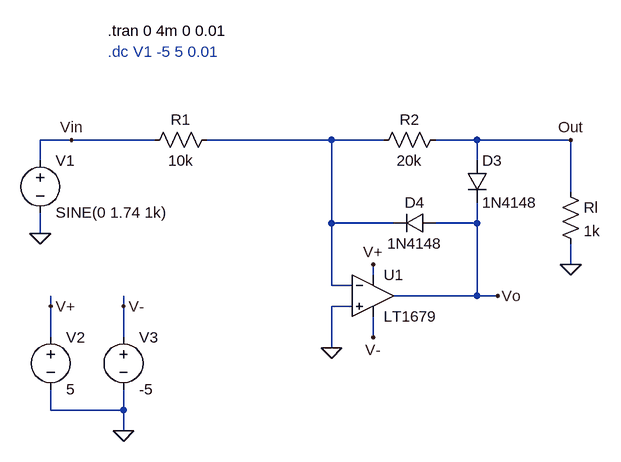
[diagram p0: schematic Etaj_4_monoalternanta.asc]
Etaj_4_monoalternanta.asc, the LTspice schematic file:
Version 4.1
SHEET 1 880 680
WIRE -528 -272 -576 -272
WIRE -400 -272 -528 -272
WIRE -128 -272 -320 -272
WIRE -48 -272 -128 -272
WIRE 96 -272 32 -272
WIRE 240 -272 96 -272
WIRE -576 -240 -576 -272
WIRE 96 -240 96 -272
WIRE 240 -192 240 -272
WIRE -128 -144 -128 -272
WIRE -32 -144 -128 -144
WIRE 96 -144 96 -176
WIRE 96 -144 32 -144
WIRE -576 -128 -576 -160
WIRE 240 -80 240 -112
WIRE -64 -64 -64 -80
WIRE -128 -48 -128 -144
WIRE -96 -48 -128 -48
WIRE 96 -32 96 -144
WIRE 96 -32 -32 -32
WIRE 128 -32 96 -32
WIRE -560 -16 -560 -32
WIRE -448 -16 -448 -32
WIRE -96 -16 -128 -16
WIRE -560 32 -560 -16
WIRE -448 32 -448 -16
WIRE -64 32 -64 0
WIRE -128 48 -128 -16
WIRE -560 144 -560 112
WIRE -448 144 -448 112
WIRE -448 144 -560 144
WIRE -448 176 -448 144
FLAG -576 -128 0
FLAG 240 -272 Out
FLAG -128 48 0
FLAG 128 -32 Vo
FLAG -448 176 0
FLAG -560 -16 V+
FLAG -448 -16 V-
FLAG -64 -80 V+
FLAG -64 32 V-
FLAG -528 -272 Vin
FLAG 240 -80 0
SYMBOL res -304 -288 R90
WINDOW 0 0 56 VBottom 2
WINDOW 3 32 56 VTop 2
SYMATTR InstName R1
SYMATTR Value 10k
SYMBOL voltage -576 -256 R0
WINDOW 123 0 0 Left 2
WINDOW 39 0 0 Left 2
SYMATTR InstName V1
SYMATTR Value SINE(0 1.74 1k)
SYMBOL voltage -560 16 R0
WINDOW 123 0 0 Left 2
WINDOW 39 0 0 Left 2
SYMATTR InstName V2
SYMATTR Value 5
SYMBOL voltage -448 16 R0
WINDOW 123 0 0 Left 2
WINDOW 39 0 0 Left 2
SYMATTR InstName V3
SYMATTR Value -5
SYMBOL res 48 -288 R90
WINDOW 0 0 56 VBottom 2
WINDOW 3 32 56 VTop 2
SYMATTR InstName R2
SYMATTR Value 20k
SYMBOL diode 80 -240 R0
SYMATTR InstName D3
SYMATTR Value 1N4148
SYMBOL diode 32 -160 R90
WINDOW 0 0 32 VBottom 2
WINDOW 3 32 32 VTop 2
SYMATTR InstName D4
SYMATTR Value 1N4148
SYMBOL res 224 -208 R0
SYMATTR InstName Rl
SYMATTR Value 1k
SYMBOL OpAmps\\LT1679 -64 -32 R0
SYMATTR InstName U1
TEXT -472 -440 Left 2 !.tran 0 4m 0 0.01
TEXT -472 -408 Left 2 ;.dc V1 -5 5 0.01

The netlist it stands for:
* Etaj_4_monoalternanta.asc
R1 N001 Vin 10k
V1 Vin 0 SINE(0 1.74 1k)
V2 V+ 0 5
V3 V- 0 -5
R2 Out N001 20k
D3 Out Vo 1N4148
D4 Vo N001 1N4148
Rl Out 0 1k
* U1: LT1679 (symbol OpAmps\LT1679 not available, pins judged from their places): In+=0 In-=N001 V+=V+ V-=V- OUT=Vo
.model D D
.lib standard.dio
.tran 0 4m 0 0.01
* .dc V1 -5 5 0.01
.backanno
.end